# Altium schematic sheet Controller-IOBoard.SchDoc
size A2
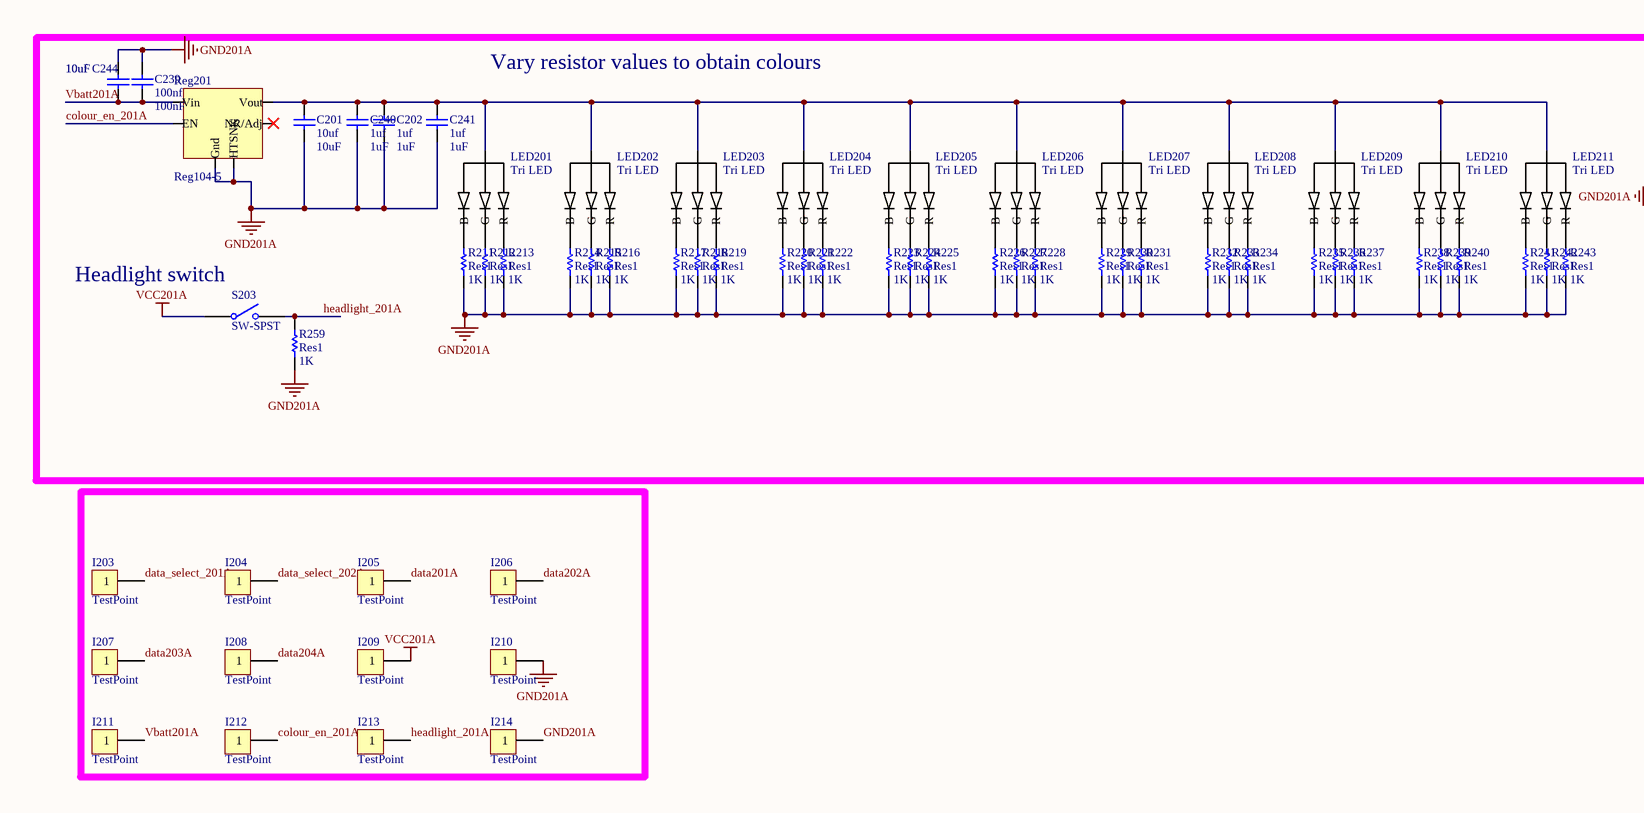
[diagram p0: Controller-IOBoard.SchDoc, left]
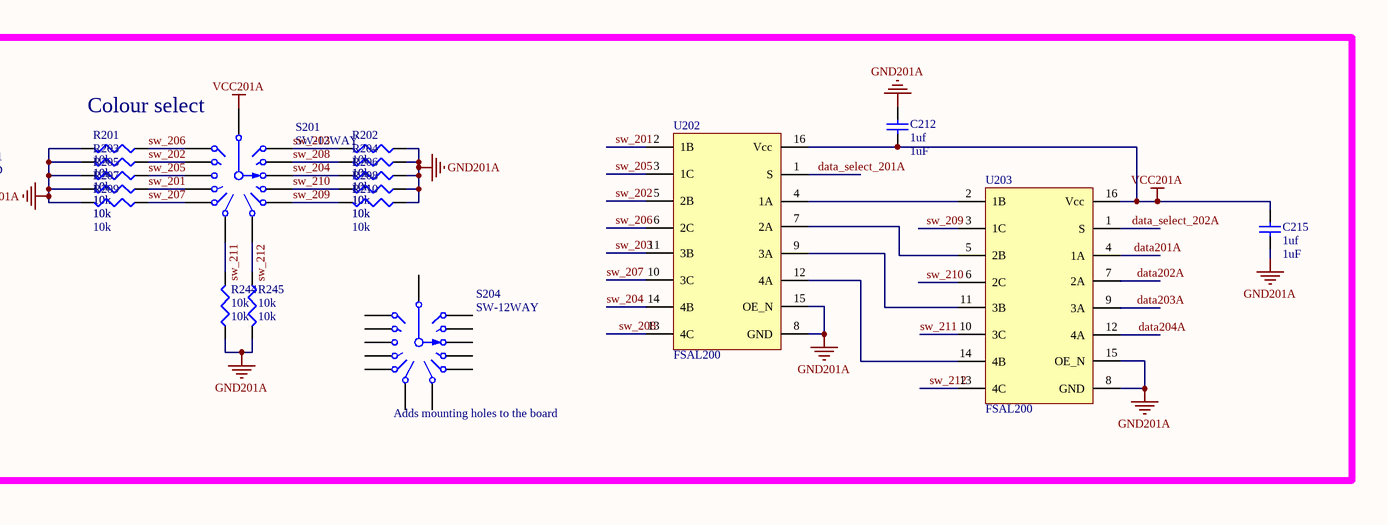
[diagram p1: Controller-IOBoard.SchDoc, right]

## Parts
C201  10uf  [0805]
C202  1uf  [0603]
C212  1uf  [0603]
C215  1uf  [0603]
C239  100nf  [0603]
C240  1uf  [0603]
C241  1uf  [0603]
C244  10uf  [0805]
I203  TestPoint  [TestPoint]
I204  TestPoint  [TestPoint]
I205  TestPoint  [TestPoint]
I206  TestPoint  [TestPoint]
I207  TestPoint  [TestPoint]
I208  TestPoint  [TestPoint]
I209  TestPoint  [TestPoint]
I210  TestPoint  [TestPoint]
I211  TestPoint  [TestPoint]
I212  TestPoint  [TestPoint]
I213  TestPoint  [TestPoint]
I214  TestPoint  [TestPoint]
LED201  Tri LED  [CLV1A-FKB]
LED202  Tri LED  [CLV1A-FKB]
LED203  Tri LED  [CLV1A-FKB]
LED204  Tri LED  [CLV1A-FKB]
LED205  Tri LED  [CLV1A-FKB]
LED206  Tri LED  [CLV1A-FKB]
LED207  Tri LED  [CLV1A-FKB]
LED208  Tri LED  [CLV1A-FKB]
LED209  Tri LED  [CLV1A-FKB]
LED210  Tri LED  [CLV1A-FKB]
LED211  Tri LED  [CLV1A-FKB]
R201  10k  [0603]
R202  10k  [0603]
R203  10k  [0603]
R204  10k  [0603]
R205  10k  [0603]
R206  10k  [0603]
R207  10k  [0603]
R208  10k  [0603]
R209  10k  [0603]
R210  10k  [0603]
R211  Res1  value 1K  [0805]
R212  Res1  value 1K  [0805]
R213  Res1  value 1K  [0805]
R214  Res1  value 1K  [0805]
R215  Res1  value 1K  [0805]
R216  Res1  value 1K  [0805]
R217  Res1  value 1K  [0805]
R218  Res1  value 1K  [0805]
R219  Res1  value 1K  [0805]
R220  Res1  value 1K  [0805]
R221  Res1  value 1K  [0805]
R222  Res1  value 1K  [0805]
R223  Res1  value 1K  [0805]
R224  Res1  value 1K  [0805]
R225  Res1  value 1K  [0805]
R226  Res1  value 1K  [0805]
R227  Res1  value 1K  [0805]
R228  Res1  value 1K  [0805]
R229  Res1  value 1K  [0805]
R230  Res1  value 1K  [0805]
R231  Res1  value 1K  [0805]
R232  Res1  value 1K  [0805]
R233  Res1  value 1K  [0805]
R234  Res1  value 1K  [0805]
R235  Res1  value 1K  [0805]
R236  Res1  value 1K  [0805]
R237  Res1  value 1K  [0805]
R238  Res1  value 1K  [0805]
R239  Res1  value 1K  [0805]
R240  Res1  value 1K  [0805]
R241  Res1  value 1K  [0805]
R242  Res1  value 1K  [0805]
R243  Res1  value 1K  [0805]
R244  10k  [0603]
R245  10k  [0603]
R259  Res1  value 1K  [0805]
Reg201  Reg104-5  [REG104-5-DDPAK5]
S201  SW-12WAY  [switch pad layout]
S203  SW-SPST  [2 pin switch (surface mount)]
S204  SW-12WAY  [12 pole switch]
U202  FSAL200  [FSAL200-16QSOP]
U203  FSAL200  [FSAL200-16QSOP]

## Nets
GND201A: C201.1 C202.1 C212.2 C215.1 C239.2 C240.1 C241.1 C244.2 I210.1 I214.1 R201.2 R202.1 R203.2 R204.1 R205.2 R206.1 R207.2 R208.1 R209.2 R210.1 R211.1 R212.1 R213.1 R214.1 R215.1 R216.1 R217.1 R218.1 R219.1 R220.1 R221.1 R222.1 R223.1 R224.1 R225.1 R226.1 R227.1 R228.1 R229.1 R230.1 R231.1 R232.1 R233.1 R234.1 R235.1 R236.1 R237.1 R238.1 R239.1 R240.1 R241.1 R242.1 R243.1 R244.1 R245.2 R259.2 Reg201.3(Gnd) Reg201.6(HTSNK) U202.8(GND) U202.15(OE_N) U203.8(GND) U203.15(OE_N)
VCC201A: C212.1 C215.2 I209.1 S201.14 S203.1(COMMON) U202.16(Vcc) U203.16(Vcc)
colour_en_201A: I212.1 Reg201.5(EN)
data201A: I205.1 U203.4(1A)
data202A: I206.1 U203.7(2A)
data203A: I207.1 U203.9(3A)
data204A: I208.1 U203.12(4A)
data_select_201A: I203.1 U202.1(S)
data_select_202A: I204.1 U203.1(S)
headlight_201A: I213.1 R259.1 S203.2(NO)
sw_201: R207.1 S201.5 U202.2(1B)
sw_202: R203.1 S201.2 U202.5(2B)
sw_203: R202.2 S201.7 U202.11(3B)
sw_204: R206.2 S201.9 U202.14(4B)
sw_205: R205.1 S201.3 U202.3(1C)
sw_206: R201.1 S201.1 U202.6(2C)
sw_207: R209.1 S201.6 U202.10(3C)
sw_208: R204.2 S201.8 U202.13(4C)
sw_209: R210.2 S201.11 U203.3(1C)
sw_210: R208.2 S201.10 U203.6(2C)
sw_211: R244.2 S201.12 U203.10(3C)
sw_212: R245.1 S201.13 U203.13(4C)
Vbatt201A: C239.1 C244.1 I211.1 Reg201.1(Vin)
NetC201_2: C201.2 C202.2 C240.2 C241.2 LED201.2(Common) LED202.2(Common) LED203.2(Common) LED204.2(Common) LED205.2(Common) LED206.2(Common) LED207.2(Common) LED208.2(Common) LED209.2(Common) LED210.2(Common) LED211.2(Common) Reg201.2(Vout)
NetLED201_1: LED201.1(R) R213.2
NetLED201_3: LED201.3(B) R211.2
NetLED201_4: LED201.4(G) R212.2
NetLED202_1: LED202.1(R) R216.2
NetLED202_3: LED202.3(B) R214.2
NetLED202_4: LED202.4(G) R215.2
NetLED203_1: LED203.1(R) R219.2
NetLED203_3: LED203.3(B) R217.2
NetLED203_4: LED203.4(G) R218.2
NetLED204_1: LED204.1(R) R222.2
NetLED204_3: LED204.3(B) R220.2
NetLED204_4: LED204.4(G) R221.2
NetLED205_1: LED205.1(R) R225.2
NetLED205_3: LED205.3(B) R223.2
NetLED205_4: LED205.4(G) R224.2
NetLED206_1: LED206.1(R) R228.2
NetLED206_3: LED206.3(B) R226.2
NetLED206_4: LED206.4(G) R227.2
NetLED207_1: LED207.1(R) R231.2
NetLED207_3: LED207.3(B) R229.2
NetLED207_4: LED207.4(G) R230.2
NetLED208_1: LED208.1(R) R234.2
NetLED208_3: LED208.3(B) R232.2
NetLED208_4: LED208.4(G) R233.2
NetLED209_1: LED209.1(R) R237.2
NetLED209_3: LED209.3(B) R235.2
NetLED209_4: LED209.4(G) R236.2
NetLED210_1: LED210.1(R) R240.2
NetLED210_3: LED210.3(B) R238.2
NetLED210_4: LED210.4(G) R239.2
NetLED211_1: LED211.1(R) R243.2
NetLED211_3: LED211.3(B) R241.2
NetLED211_4: LED211.4(G) R242.2
NetU202_4: U202.4(1A) U203.2(1B)
NetU202_7: U202.7(2A) U203.5(2B)
NetU202_9: U202.9(3A) U203.11(3B)
NetU202_12: U202.12(4A) U203.14(4B)

Not connected (* = marked no-connect by the designer): Reg201 4(NR/Adj)*; S204 1 2 3 5 6 7 8 9 10 11 12 13 14

## Notes on the sheet
- Vary resistor values to obtain colours
- (near S201) Colour select
- (near S203) Headlight switch
- (near S204) Adds mounting holes to the board

## Library data of the parts
C201 C202 C212 C215 C239-C241 C244 = Cap Semi: Capacitor (Semiconductor SIM Model); Published: 8-Jun-2000; LatestRevisionDate: 29-May-2009; LatestRevisionNote: IPC-7351 Footprint Added.; PackageReference: C1206; Publisher: Altium Limited; PackageDescription: Chip Capacitor
  C201 C244: Value: 10uF
  C202 C212 C215 C240 C241: Value: 1uF
  C239: Value: 100nF
R201-R210 R244 R245 = Res3: Resistor; Published: 8-Jun-2000; LatestRevisionDate: 29-May-2009; LatestRevisionNote: IPC-7351 Footprint Added.; PackageReference: J1-0603; Publisher: Altium Limited; PackageDescription: Chip Resistor; Value: 10k
R211-R243 R259 = Res1: Resistor; Published: 8-Jun-2000; LatestRevisionDate: 17-Jul-2002; LatestRevisionNote: Re-released for DXP Platform.; PackageReference: AXIAL-0.3; Publisher: Altium Limited
S201 S204 = SW-12WAY: 12 Way Switch; Published: 24-Mar-1999; LatestRevisionDate: 17-Jul-2002; LatestRevisionNote: Re-released for DXP Platform.; PackageReference: DIP-13(14); Publisher: Altium Limited
S203 = SW-SPST: Single-Pole, Single-Throw Switch; Published: 24-Mar-1999; LatestRevisionDate: 17-Jul-2002; LatestRevisionNote: Re-released for DXP Platform.; PackageReference: SPST-2; Publisher: Altium Limited
U202 U203 = FSAL200: ST Quad Bi-Directional Logic Switch